# Altium project fNIRS_ECU.PrjPcb (part 2 of 3)

## Sheet MCU.SchDoc: fNIRS - MCU
size A3; CompanyName: UofT Capstone Team 2024991; Revision: 1; SheetNumber: 3; SheetTotal: 13
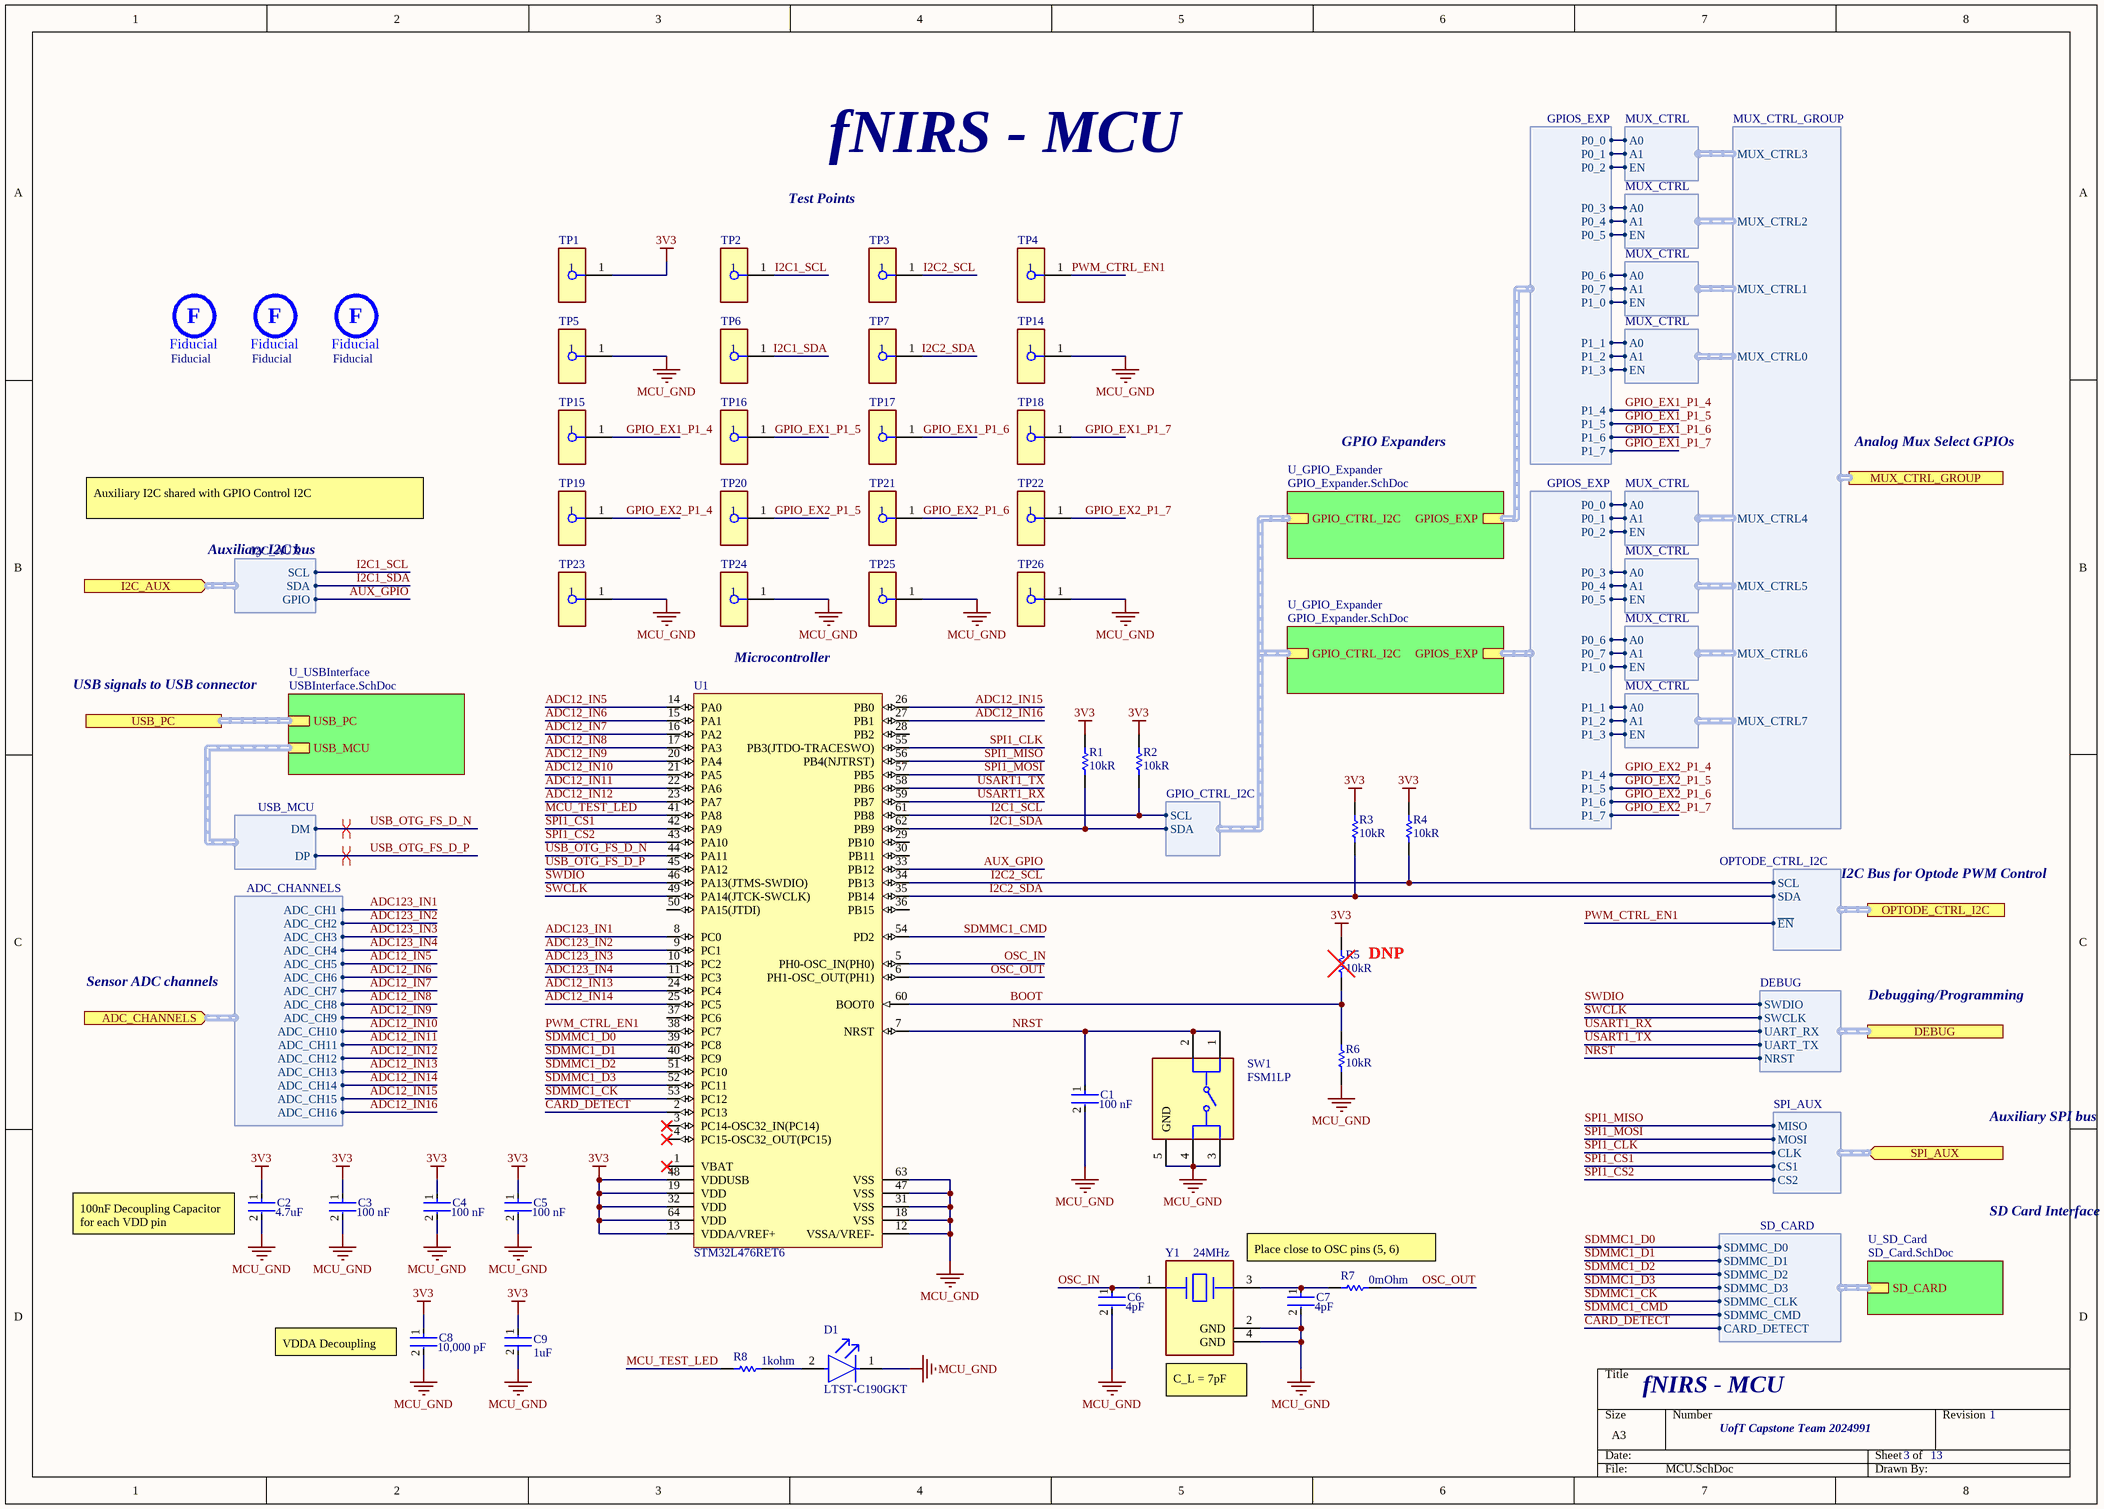
[diagram p7: MCU.SchDoc]

### Parts
C1  Capacitance: 100 nF  [FP-CC0603-DA-MFG]  (hidden comment: CC0603KRX7R7BB104)
C2  Capacitance: 4.7uF  [FP-C0603-CG-MFG]  (hidden comment: C0603C475K9PACTU)
C3  Capacitance: 100 nF  [FP-CC0603-DA-MFG]  (hidden comment: CC0603KRX7R7BB104)
C4  Capacitance: 100 nF  [FP-CC0603-DA-MFG]  (hidden comment: CC0603KRX7R7BB104)
C5  Capacitance: 100 nF  [FP-CC0603-DA-MFG]  (hidden comment: CC0603KRX7R7BB104)
C6  Capacitance: 4pF  [FP-CL10-IPC_A]  (hidden comment: CL10C040CB8NNNC)
C7  Capacitance: 4pF  [FP-CL10-IPC_A]  (hidden comment: CL10C040CB8NNNC)
C8  Capacitance: 10,000 pF  [FP-C0603C-CF-MFG]  (hidden comment: C0603C103K2RACTU)
C9  Capacitance: 1uF  [FP-C1608-080-0_1-IPC_B]  (hidden comment: C1608X5R1H105K080AB)
D1  LTST-C190GKT  [FP-LTST-C190GKT-MFG]
Fi1  Fiducial  [Fiducial-Footprint-1]
Fi2  Fiducial  [Fiducial-Footprint-1]
Fi3  Fiducial  [Fiducial-Footprint-1]
R1  Resistance: 10kR  [RESC1609X50X30NL8T20]  (hidden comment: CRCW060310K0FKEA)
R2  Resistance: 10kR  [RESC1609X50X30NL8T20]  (hidden comment: CRCW060310K0FKEA)
R3  Resistance: 10kR  [RESC1609X50X30NL8T20]  (hidden comment: CRCW060310K0FKEA)
R4  Resistance: 10kR  [RESC1609X50X30NL8T20]  (hidden comment: CRCW060310K0FKEA)
R5  Resistance: 10kR  [RESC1609X50X30NL8T20]  (hidden comment: CRCW060310K0FKEA)  (no BOM)
R6  Resistance: 10kR  [RESC1609X50X30NL8T20]  (hidden comment: CRCW060310K0FKEA)
R7  Resistance: 0mOhm  [RESC1608X55X25ML10T15]  (hidden comment: RC0603JR-070RL)
R8  Resistance: 1kohm  [RESC1608X55X25ML10T15]  (hidden comment: RC0603JR-071KL)
SW1  FSM1LP  [FP-FSM1LP-MFG]
TP1  S2761-46R  [FP-S2761-46R-MFG]  (value not drawn)
TP2  S2761-46R  [FP-S2761-46R-MFG]  (value not drawn)
TP3  S2761-46R  [FP-S2761-46R-MFG]  (value not drawn)
TP4  S2761-46R  [FP-S2761-46R-MFG]  (value not drawn)
TP5  S2761-46R  [FP-S2761-46R-MFG]  (value not drawn)
TP6  S2761-46R  [FP-S2761-46R-MFG]  (value not drawn)
TP7  S2761-46R  [FP-S2761-46R-MFG]  (value not drawn)
TP14  S2761-46R  [FP-S2761-46R-MFG]  (value not drawn)
TP15  S2761-46R  [FP-S2761-46R-MFG]  (value not drawn)
TP16  S2761-46R  [FP-S2761-46R-MFG]  (value not drawn)
TP17  S2761-46R  [FP-S2761-46R-MFG]  (value not drawn)
TP18  S2761-46R  [FP-S2761-46R-MFG]  (value not drawn)
TP19  S2761-46R  [FP-S2761-46R-MFG]  (value not drawn)
TP20  S2761-46R  [FP-S2761-46R-MFG]  (value not drawn)
TP21  S2761-46R  [FP-S2761-46R-MFG]  (value not drawn)
TP22  S2761-46R  [FP-S2761-46R-MFG]  (value not drawn)
TP23  S2761-46R  [FP-S2761-46R-MFG]  (value not drawn)
TP24  S2761-46R  [FP-S2761-46R-MFG]  (value not drawn)
TP25  S2761-46R  [FP-S2761-46R-MFG]  (value not drawn)
TP26  S2761-46R  [FP-S2761-46R-MFG]  (value not drawn)
U1  STM32L476RET6  [STM-LQFP64_L]
Y1  Frequency: 24MHz  [FP-ABM11W-MFG]  (hidden comment: ABM11W-24.0000MHZ-7-B1U-T3)

### Sub-sheets
U_GPIO_Expander = GPIO_Expander.SchDoc: GPIO_CTRL_I2C (harness GPIO_CTRL_I2C), GPIOS_EXP (harness GPIOS_EXP)
U_GPIO_Expander = GPIO_Expander.SchDoc: GPIO_CTRL_I2C (harness GPIO_CTRL_I2C), GPIOS_EXP (harness GPIOS_EXP)
U_SD_Card = SD_Card.SchDoc: SD_CARD (harness SD_CARD)
U_USBInterface = USBInterface.SchDoc: USB_MCU (harness USB_MCU), USB_PC (harness USB_PC)

### Ports
ADC_CHANNELS (in, harness ADC_CHANNELS, see Top[2C], Sensing[8C]), DEBUG (harness DEBUG, see Top[3C], Connectors[5C]), I2C_AUX (in, harness I2C_AUX, see Top[3C], Connectors[7B], OptodeConnectors[2B]), MUX_CTRL_GROUP (harness MUX_CTRL_GROUP, see Top[2C], Sensing[1A]), OPTODE_CTRL_I2C (harness OPTODE_CTRL_I2C, see Top[2C], OptodeControl[2B]), SPI_AUX (in, harness SPI_AUX, see Top[3C], Connectors[7B], OptodeConnectors[2A]), USB_PC (harness USB_PC, see Top[3C], Connectors[2C], USBInterface[1C])

### Harnesses
ADC_CHANNELS: ADC_CH1, ADC_CH2, ADC_CH3, ADC_CH4, ADC_CH5, ADC_CH6, ADC_CH7, ADC_CH8, ADC_CH9, ADC_CH10, ADC_CH11, ADC_CH12, ADC_CH13, ADC_CH14, ADC_CH15, ADC_CH16
GPIO_CTRL_I2C: SCL, SDA
USB_MCU: DM, DP
DEBUG: SWDIO, SWCLK, UART_RX, UART_TX, NRST
OPTODE_CTRL_I2C: SCL, SDA, ~{EN}
GPIOS_EXP: P0_0, P0_1, P0_2, P0_3, P0_4, P0_5, P0_6, P0_7, P1_0, P1_1, P1_2, P1_3, P1_4, P1_5, P1_6, P1_7
SPI_AUX: MISO, MOSI, CLK, CS1, CS2
SD_CARD: SDMMC_D0, SDMMC_D1, SDMMC_D2, SDMMC_D3, SDMMC_CLK, SDMMC_CMD, CARD_DETECT
MUX_CTRL: A0, A1, EN
MUX_CTRL_GROUP: MUX_CTRL0, MUX_CTRL1, MUX_CTRL3, MUX_CTRL2, MUX_CTRL4, MUX_CTRL5, MUX_CTRL6, MUX_CTRL7
I2C_AUX: SCL, SDA, GPIO

### Nets
3V3: C2.1 C3.1 C4.1 C5.1 C8.1 C9.1 R1.2 R2.2 R3.2 R4.2 R5.2 TP1.1 U1.13(VDDA/VREF+) U1.19(VDD) U1.32(VDD) U1.48(VDDUSB) U1.64(VDD)
MCU_GND: C1.2 C2.2 C3.2 C4.2 C5.2 C6.2 C7.2 C8.2 C9.2 D1.1(C) R6.1 SW1.3 SW1.4 SW1.5(GND) TP5.1 TP14.1 TP23.1 TP24.1 TP25.1 TP26.1 U1.12(VSSA/VREF-) U1.18(VSS) U1.31(VSS) U1.47(VSS) U1.63(VSS) Y1.2(GND) Y1.4(GND)
ADC12_IN5: U1.14(PA0) ; port ADC_CHANNELS.ADC_CH5
ADC12_IN6: U1.15(PA1) ; port ADC_CHANNELS.ADC_CH6
ADC12_IN7: U1.16(PA2) ; port ADC_CHANNELS.ADC_CH7
ADC12_IN8: U1.17(PA3) ; port ADC_CHANNELS.ADC_CH8
ADC12_IN9: U1.20(PA4) ; port ADC_CHANNELS.ADC_CH9
ADC12_IN10: U1.21(PA5) ; port ADC_CHANNELS.ADC_CH10
ADC12_IN11: U1.22(PA6) ; port ADC_CHANNELS.ADC_CH11
ADC12_IN12: U1.23(PA7) ; port ADC_CHANNELS.ADC_CH12
ADC12_IN13: U1.24(PC4) ; port ADC_CHANNELS.ADC_CH13
ADC12_IN14: U1.25(PC5) ; port ADC_CHANNELS.ADC_CH14
ADC12_IN15: U1.26(PB0) ; port ADC_CHANNELS.ADC_CH15
ADC12_IN16: U1.27(PB1) ; port ADC_CHANNELS.ADC_CH16
ADC123_IN1: U1.8(PC0) ; port ADC_CHANNELS.ADC_CH1
ADC123_IN2: U1.9(PC1) ; port ADC_CHANNELS.ADC_CH2
ADC123_IN3: U1.10(PC2) ; port ADC_CHANNELS.ADC_CH3
ADC123_IN4: U1.11(PC3) ; port ADC_CHANNELS.ADC_CH4
AUX_GPIO: U1.33(PB12) ; port I2C_AUX.GPIO
BOOT: R5.1 R6.2 U1.60(BOOT0)
CARD_DETECT: U1.2(PC13) ; sheet U_SD_Card/SD_CARD.CARD_DETECT
GPIO_EX1_P1_4: TP15.1 ; sheet U_GPIO_Expander/GPIOS_EXP.P1_4
GPIO_EX1_P1_5: TP16.1 ; sheet U_GPIO_Expander/GPIOS_EXP.P1_5
GPIO_EX1_P1_6: TP17.1 ; sheet U_GPIO_Expander/GPIOS_EXP.P1_6
GPIO_EX1_P1_7: TP18.1 ; sheet U_GPIO_Expander/GPIOS_EXP.P1_7
GPIO_EX2_P1_4: TP19.1 ; sheet U_GPIO_Expander/GPIOS_EXP.P1_4
GPIO_EX2_P1_5: TP20.1 ; sheet U_GPIO_Expander/GPIOS_EXP.P1_5
GPIO_EX2_P1_6: TP21.1 ; sheet U_GPIO_Expander/GPIOS_EXP.P1_6
GPIO_EX2_P1_7: TP22.1 ; sheet U_GPIO_Expander/GPIOS_EXP.P1_7
GPIO_P0_0: sheet U_GPIO_Expander/GPIOS_EXP.P0_0, harness MUX_CTRL.A0
GPIO_P0_0: sheet U_GPIO_Expander/GPIOS_EXP.P0_0, harness MUX_CTRL.A0  [a separate net that carries the same name]
GPIO_P0_1: sheet U_GPIO_Expander/GPIOS_EXP.P0_1, harness MUX_CTRL.A1
GPIO_P0_1: sheet U_GPIO_Expander/GPIOS_EXP.P0_1, harness MUX_CTRL.A1  [a separate net that carries the same name]
GPIO_P0_2: sheet U_GPIO_Expander/GPIOS_EXP.P0_2, harness MUX_CTRL.EN
GPIO_P0_2: sheet U_GPIO_Expander/GPIOS_EXP.P0_2, harness MUX_CTRL.EN  [a separate net that carries the same name]
GPIO_P0_3: sheet U_GPIO_Expander/GPIOS_EXP.P0_3, harness MUX_CTRL.A0
GPIO_P0_3: sheet U_GPIO_Expander/GPIOS_EXP.P0_3, harness MUX_CTRL.A0  [a separate net that carries the same name]
GPIO_P0_4: sheet U_GPIO_Expander/GPIOS_EXP.P0_4, harness MUX_CTRL.A1
GPIO_P0_4: sheet U_GPIO_Expander/GPIOS_EXP.P0_4, harness MUX_CTRL.A1  [a separate net that carries the same name]
GPIO_P0_5: sheet U_GPIO_Expander/GPIOS_EXP.P0_5, harness MUX_CTRL.EN
GPIO_P0_5: sheet U_GPIO_Expander/GPIOS_EXP.P0_5, harness MUX_CTRL.EN  [a separate net that carries the same name]
GPIO_P0_6: sheet U_GPIO_Expander/GPIOS_EXP.P0_6, harness MUX_CTRL.A0
GPIO_P0_6: sheet U_GPIO_Expander/GPIOS_EXP.P0_6, harness MUX_CTRL.A0  [a separate net that carries the same name]
GPIO_P0_7: sheet U_GPIO_Expander/GPIOS_EXP.P0_7, harness MUX_CTRL.A1
GPIO_P0_7: sheet U_GPIO_Expander/GPIOS_EXP.P0_7, harness MUX_CTRL.A1  [a separate net that carries the same name]
GPIO_P1_0: sheet U_GPIO_Expander/GPIOS_EXP.P1_0, harness MUX_CTRL.EN
GPIO_P1_0: sheet U_GPIO_Expander/GPIOS_EXP.P1_0, harness MUX_CTRL.EN  [a separate net that carries the same name]
GPIO_P1_1: sheet U_GPIO_Expander/GPIOS_EXP.P1_1, harness MUX_CTRL.A0
GPIO_P1_1: sheet U_GPIO_Expander/GPIOS_EXP.P1_1, harness MUX_CTRL.A0  [a separate net that carries the same name]
GPIO_P1_2: sheet U_GPIO_Expander/GPIOS_EXP.P1_2, harness MUX_CTRL.A1
GPIO_P1_2: sheet U_GPIO_Expander/GPIOS_EXP.P1_2, harness MUX_CTRL.A1  [a separate net that carries the same name]
GPIO_P1_3: sheet U_GPIO_Expander/GPIOS_EXP.P1_3, harness MUX_CTRL.EN
GPIO_P1_3: sheet U_GPIO_Expander/GPIOS_EXP.P1_3, harness MUX_CTRL.EN  [a separate net that carries the same name]
I2C1_SCL: R2.1 TP2.1 U1.61(PB8) ; sheet U_GPIO_Expander/GPIO_CTRL_I2C.SCL, port I2C_AUX.SCL
I2C1_SDA: R1.1 TP6.1 U1.62(PB9) ; sheet U_GPIO_Expander/GPIO_CTRL_I2C.SDA, port I2C_AUX.SDA
I2C2_SCL: R4.1 TP3.1 U1.34(PB13) ; port OPTODE_CTRL_I2C.SCL
I2C2_SDA: R3.1 TP7.1 U1.35(PB14) ; port OPTODE_CTRL_I2C.SDA
MCU_TEST_LED: R8.1 U1.41(PA8)
NRST: C1.1 SW1.1 SW1.2 U1.7(NRST) ; port DEBUG.NRST
OSC_IN: C6.1 U1.5(PH0-OSC_IN(PH0)) Y1.1
OSC_OUT: R7.2 U1.6(PH1-OSC_OUT(PH1))
PWM_CTRL_EN1: TP4.1 U1.38(PC7) ; port OPTODE_CTRL_I2C.~{EN}
SDMMC1_CK: U1.53(PC12) ; sheet U_SD_Card/SD_CARD.SDMMC_CLK
SDMMC1_CMD: U1.54(PD2) ; sheet U_SD_Card/SD_CARD.SDMMC_CMD
SDMMC1_D0: U1.39(PC8) ; sheet U_SD_Card/SD_CARD.SDMMC_D0
SDMMC1_D1: U1.40(PC9) ; sheet U_SD_Card/SD_CARD.SDMMC_D1
SDMMC1_D2: U1.51(PC10) ; sheet U_SD_Card/SD_CARD.SDMMC_D2
SDMMC1_D3: U1.52(PC11) ; sheet U_SD_Card/SD_CARD.SDMMC_D3
SPI1_CLK: U1.55(PB3(JTDO-TRACESWO)) ; port SPI_AUX.CLK
SPI1_CS1: U1.42(PA9) ; port SPI_AUX.CS1
SPI1_CS2: U1.43(PA10) ; port SPI_AUX.CS2
SPI1_MISO: U1.56(PB4(NJTRST)) ; port SPI_AUX.MISO
SPI1_MOSI: U1.57(PB5) ; port SPI_AUX.MOSI
SWCLK: U1.49(PA14(JTCK-SWCLK)) ; port DEBUG.SWCLK
SWDIO: U1.46(PA13(JTMS-SWDIO)) ; port DEBUG.SWDIO
USART1_RX: U1.59(PB7) ; port DEBUG.UART_RX
USART1_TX: U1.58(PB6) ; port DEBUG.UART_TX
USB_OTG_FS_D_N: U1.44(PA11) ; sheet U_USBInterface/USB_MCU.DM
USB_OTG_FS_D_P: U1.45(PA12) ; sheet U_USBInterface/USB_MCU.DP
NetC7_1: C7.1 R7.1 Y1.3
NetD1_2: D1.2(A) R8.2

Not connected (* = marked no-connect by the designer): U1 1(VBAT)* 3(PC14-OSC32_IN(PC14))* 4(PC15-OSC32_OUT(PC15))* 28(PB2) 29(PB10) 30(PB11) 36(PB15) 37(PC6) 50(PA15(JTDI))

### Buses and harness runs
harness port USB_PC = sheet U_USBInterface/USB_PC

### Layout directives
differential pair: USB_OTG_FS_D_N, USB_OTG_FS_D_P

### Notes on the sheet
- fNIRS - MCU
- Test Points
- GPIO Expanders
- Analog Mux Select GPIOs
- Auxiliary I2C shared with GPIO Control I2C
- Auxiliary I2C bus
- USB signals to USB connector
- Microcontroller
- I2C Bus for Optode PWM Control
- Sensor ADC channels
- (near R5) DNP
- Debugging/Programming
- Auxiliary SPI bus
- (near C2) 100nF Decoupling Capacitor for each VDD pin
- Place close to OSC pins (5, 6)
- SD Card Interface
- (near C8) VDDA Decoupling
- (near Y1) C_L = 7pF
- (in symbol CMP-ROOT-0065-2) F

### Library data of the parts
C1 C3-C5 = CMP-2000-05002-2: CAP CER 0.1UF 16V X7R 0603; Manufacturer: YAGEO; Tolerance: 0.1; Value: 100 nF; Temperature Coefficient: 15%; Material: Ceramic; Voltage Rating: 16 V; Package: CC0603-DA; ComponentLink2Description: Datasheet; Octopart: https://octopart.com/cc0603krx7r7bb104-yageo-192941; Temperature Range High: +125°C; Digikey Description: CAP CER 0.1UF 16V X7R 0603; Voltage: 16 V; Device Class L2: Capacitors; Height: 0.9mm; Temperature: -55°C to +125°C; Manufacturer Part Number: CC0603KRX7R7BB104; Device Class L1: Passive Components; Device Class L3: Ceramic Capacitors; ComponentLink2URL: http://www.yageo.com/documents/recent/UPY-GPHC_X7R_6.3V-to-50V_18.pdf; Footprint Url: http://www.yageo.com/exep/pages/download/literatures/UPY-C_GEN_24.pdf; RoHS: TRUE; Temperature Range Low: -55°C; Temperature Characteristic: X7R; Lead Free: Yes; Category: Cap; Mouser Description: Multilayer Ceramic Capacitor, CC Series, 0.1 - F, - 10%, X7R, 16 V, 0603 [1608 Metric]; Automotive: No
C2 = CMP-2006-02256-2: CAP CER 4.7UF 6.3V X5R 0603; Manufacturer: Kemet; Temperature Coefficient: 15%; Tolerance: 10%; Material: Ceramic; Device Class L3: Ceramic Capacitors; RoHS: TRUE; Value: 4.7uF; Lead Free: Yes; ComponentLink2Description: Datasheet; Mouser Description: Multilayer Ceramic Capacitors MLCC - SMD/SMT 6.3volts 4.7uF X5R 10%; Package: C0603-CG; Digikey Description: CAP CER 4.7UF 6.3V X5R 0603; ComponentLink2URL: https://content.kemet.com/datasheets/KEM_C1006_X5R_SMD.pdf; Category: Cap; Temperature Range Low: -55°C; Temperature: -55°C to +85°C; Octopart: https://octopart.com/c0603c475k9pactu-kemet-104242; Ipc Land Pattern Name: CAPC16080X80; Voltage Rating: 6.3V; Temperature Range High: +85°C; Height: 0.9mm; Temperature Characteristic: X5R; Device Class L1: Passive Components; Manufacturer Part Number: C0603C475K9PACTU; Automotive: No; Device Class L2: Capacitors
C6 C7 = CMP-13271-003969-1: Cap Ceramic 4pF 50V C0G ±0.25pF Pad SMD 0603 +125°C T/R; Tolerance: -0.25%; Case Code (Imperial): 0603; Packaging: Tape and Reel; Contact Plating: Tin; Thickness: 0.035inch; Dielectric: C0G; Max Operating Temperature: 125°C; Voltage Rating: 50V; Radiation Hardening: No; Case Code (Metric): 1608; Depth: 0.8mm; Mount: Surface Mount; Lead Free: Lead Free; Height: 0.8mm; Package Quantity: 1; Case/Package: 0603; Min Operating Temperature: -55°C; Voltage Rating (DC): 50V; Length: 1.6mm; Width: 0.031inch
C8 = CMP-2006-03038-2: CAP CER 10000PF 200V X7R 0603; Manufacturer: KEMET; Material: Ceramic; Value: 10,000 pF; Temperature Coefficient: 30ppm/°C; Tolerance: 0.1; Automotive Grade: Grade 1; Voltage Rating: 200 V; Manufacturer Part Number: C0603C103K2RACTU; ComponentLink2Description: Datasheet; Package: C0603C-CF; Device Class L2: Capacitors; Mouser Description: Multilayer Ceramic Capacitors MLCC - SMD/SMT 200volts 10000pF X7R 10%; Device Class L3: Ceramic Capacitors; Temperature Range Low: -55°C; Category: Cap; Device Class L1: Passive Components; Lead Free: Yes; Octopart: https://octopart.com/c0603c103k2ractu-kemet-1061947; ComponentLink2URL: https://api.kemet.com/component-edge/download/datasheet/C0603C100J5GACAUTO.pdf; Temperature Characteristic: X7R; Temperature: -55°C to +125°C; Automotive: Yes; Temperature Range High: +125°C; Digikey Description: CAP CER 10000PF 200V X7R 0603; Height: 0.87mm; RoHS: TRUE
C9 = CMP-2000-06025-2: Multilayer Ceramic Capacitors 1μF ±10% 50V X5R SMD 0603; Lead Free: Lead Free; Height: 0.8mm; Mount: Surface Mount; Radiation Hardening: No; Thickness: 0.035inch; Length: 1.6mm; Max Operating Temperature: 85°C; REACH SVHC: No SVHC; Min Operating Temperature: -55°C; Construction: Flat; RoHS Compliant: Yes; Voltage Rating: 50V; Dielectric: X5R; Packaging: Tape and Reel; Termination: SMD/SMT; Voltage Rating (DC): 50V; Case Code (Imperial): 0603; Voltage: 50V; Width: 0.031inch; Weight: 7.1E-05oz; Depth: 0.8mm; Case Code (Metric): 1608; Series: C; Case/Package: 0603; Tolerance: 10%; Resistor Type: Ceramic; Number of Pins: 2; Dielectric Material: Ceramic; Package Quantity: 1
D1 = CMP-22017-000005-2: LED GREEN CLEAR CHIP SMD; Dominant Wavelength: 569nm; Reverse Voltage: 5V; Lens Color: Colorless; Viewing Angle: 130°; Voltage: 2V; Forward Current: 30mA; Power Dissipation: 100mW; Luminous Intensity: 6mcd; Number of LEDs: 1; Forward Voltage: 2.1V; Wavelength: 565nm; Test Current: 10mA; Min Operating Temperature: -55°C; Lens Style: Clear; Mount: Surface Mount; Width: 0.8mm; Packaging: Tape and Reel; Lens Transparency: Clear; Case Code (Metric): 1608; Depth: 0.8mm; Case Code (Imperial): 0603; Case/Package: 0603; Number of Pins: 2; Max Operating Temperature: 85°C; Lead Free: Lead Free; Number of Elements: 1; Length: 1.6mm; Height: 0.8mm; Package Quantity: 1; Power Rating: 100mW; Radiation Hardening: No; Illumination Color: Green; Color: Green
Fi1-Fi3 = CMP-ROOT-0065-2: Fiducial for pick-and-place; Mount: TH; RoHS: Yes
R1-R6 = CMP-1666-00005-4: Chip Resistor, 10 KOhm, +/- 1%, 100 mW, -55 to 155 degC, 0603 (1608 Metric), RoHS, Tape and Reel; Manufacturer: Vishay Semiconductor; Voltage Rating: 75 V; Max Operating Temperature: 155 degC; PackageDescription: 2-Pin Surface Mount Device, Body 1.575 x 0.85 mm; ComponentLink1Description: Manufacturer URL; RoHSCompliant: true; PackageReference: 0603; REACH SVHC: Unknown; Length: 1.55 mm; DatasheetVersion: 06/2012; Packaging: Tape and Reel; Min Operating Temperature: -55 degC; Mounting Technology: Surface Mount; ComponentLink2URL: https://datasheet.ciiva.com/11809/0900766b80d98afc-11809037.pdf; Height: 0.45 mm; ComponentLink2Description: Datasheet; Package Quantity: 5000; ComponentLink1URL: http://www.vishay.com/
R7 = CMP-2100-03667-1: Chip Resistor, 0 Ohm, +/- 5%, 0.1 W, -55 to 155 degC, 0603 (1608 Metric), RoHS, Tape and Reel; Manufacturer: Yageo; Temperature Coefficient: 200ppm/degreesC; Voltage Rating: 50V; Power Rating: 100mW; Width: 0.8mm; Max Operating Temperature: 155degC; Tolerance: 5%; Package Reference: 0603; Height: 0.45mm; Depth: 0.8mm; Package Description: 2-Pin Surface Mount Device, Body 1.6 x 0.8 mm; Termination: SMD/SMT; Package Quantity: 5000; Case/Package: 0603; Case Code (Imperial): 0603; Radiation Hardening: No; Number of Pins: 2; Length: 1.6mm; Lead Free: LeadFree; Voltage Rating (DC): 50V; Military Standard: Not; Datasheet URL: http://www.yageo.com/NewPortal/yageodocoutput?fileName=/pdf/R-Chip/PYu-RC_Group_51_RoHS_L_5.pdf; Manufacturer URL: http://www.yageo.com/; Packaging: TapeandReel; Case Code (Metric): 1608; Min Operating Temperature: -55degC; Composition: ThickFilm; RoHSCompliant: true; Contact Plating: Tin; Datasheet Version: Rev. 5, 10/2016; REACH SVHC: NoSVHC
R8 = CMP-2000-05023-1: Chip Resistor, 1 KOhm, +/- 5%, 0.063 W, -55 to 155 degC, 0603 (1608 Metric), RoHS, Tape and Reel; Manufacturer: Yageo; Resistor Case Style: 0603[1608Metric]; Resistor Element Type: ThickFilm; Product Range: RCSeries; SVHC: ToBeAdvised; Voltage Rating: 50V; Temperature Coefficient: ±100ppm/degC; Power Rating: 100mW; Packaging: CutTape; Manufacturer URL: http://www.yageo.com/; Resistance Tolerance: ±5%; Datasheet Version: Rev. 4, 04/2009; MSL: MSL1-Unlimited; Package Description: 2-Pin Surface Mount Device, Body 1.6 x 0.8 mm; Automotive Qualification Standard: -; Package Reference: 603; Datasheet URL: https://datasheet.ciiva.com/2452/pyu-rc0603-51-rohs-l-4-2452848.pdf
SW1 = CMP-03402-000015-1: SWITCH TACTILE SPST-NO 0.05A 24V; Electrical Life: 100000Cycles; Actuator Type: Standard; Contact Resistance: 100mR; Current Rating: 50mA; Operating Force: 1.57N; Actuator Material: Polyphthalamide; Illumination Type: Non-Illuminated; Actuator Length: 0.01inch; Voltage Rating (DC): 12V; Throw Configuration: SPST; Switch Travel: 0.25mm; Switch Function: Off-Mom; Actuator Color: Black; Length: 6.19mm; Min Operating Temperature: -35°C; Contact Material: Copper Alloy; Max Current Rating: 50mA; Max Operating Temperature: 85°C; Packaging: Loose Piece; Lead Free: Lead Free; Mount: Surface Mount; RoHS Compliant: Yes; Orientation: Straight; Package Quantity: 2000; Mechanical Life: 100000Cycles; Type: Switch; ELV: Compliant; Depth: 8mm; Contact Plating: Silver; Max Voltage Rating (DC): 12V; REACH SVHC: No SVHC; Series: FSM1LP; Contact Current Rating: 50mA; Termination: Gull Wing
TP1-TP7 TP14-TP26 = CMP-15817-000011-1: PC TEST POINT NATURAL; Body Material: Brass; Plating: Tin; Material: Copper Alloy; Mount: Surface Mount; Color: Natural; Packaging: Tape and Reel; RoHS Compliant: Yes
U1 = CMP-1655-00011-2: Ultra-Low-Power ARM Cortex-M4 32-bit MCU+FPU, 512 KB Flash, 128 KB Internal RAM, 51 I/Os, 64-Pin LQFP, -40 to 85 degC, Tray; Manufacturer: STMicroelectronics; Internal RAM Size (kB): 128; I/Os (High Current): 51; Operating Frequency(F) (Processor speed) (MHz): 80; FLASH Size (Prog) (kB): 512; D/A Converter: 2; Supply Voltage(Vcc) min (V): 1.71; Packing: Tray; DatasheetVersion: Rev. 4; PartNumber: STM32L476RET6; ComponentLink1URL: http://www.st.com/; Package Reference: LQFP64; Package Description: 64-Pin Low-profile Quad Flat Package, Body 10 x 10 mm, Pitch 0.5 mm; Mounting Technology: Surface Mount; ComponentLink1Description: Manufacturer URL; ComponentLink2Description: Datasheet; Core: ARM Cortex-M4; ComponentLink2URL: http://www.st.com/st-web-ui/static/active/en/resource/technical/document/datasheet/DM00108832.pdf
Y1 = CMP-27762-000556-1: Crystal 24MHz ±10ppm 7pF SMD-4 2mm x 1.6mm; RoHS Compliant: Yes

## Sheet GPIO_Expander.SchDoc: fNIRS - GPIO Expander
size A4; CompanyName: UofT Capstone Team 2024991; Revision: 1; SheetNumber: 4; SheetTotal: 13
Used 2 times, as channels U_MCU/U_GPIO_Expander, U_MCU/U_GPIO_Expander. Parts and nets are listed once, with the designators drawn on the sheet.
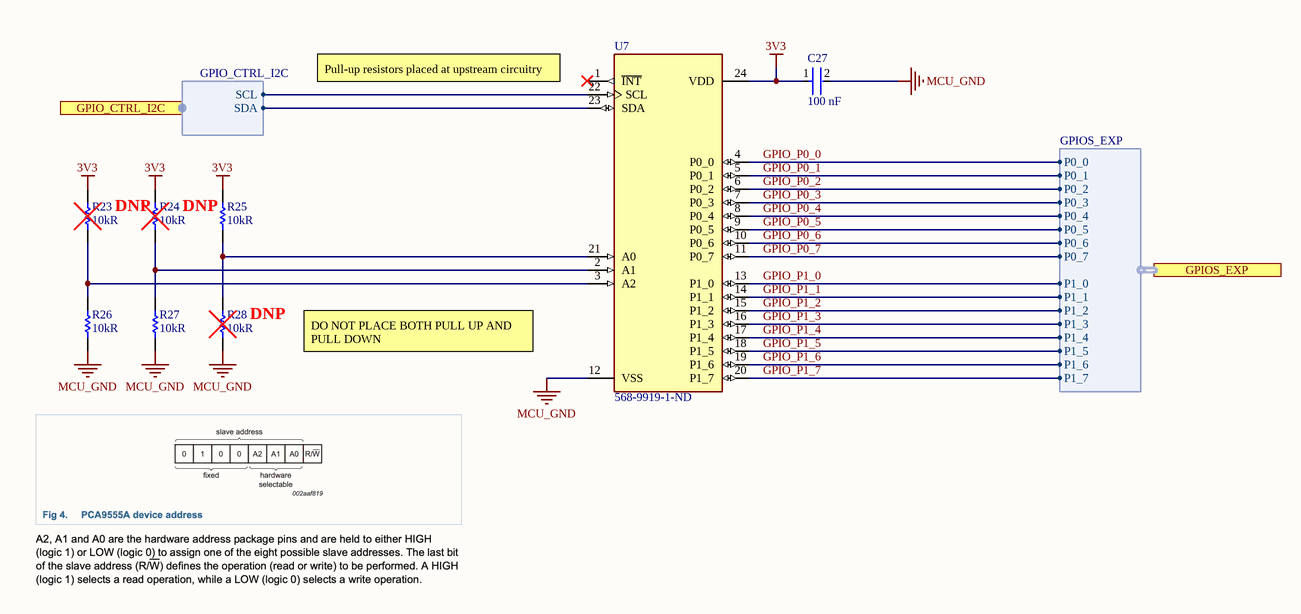
[diagram p8: GPIO_Expander.SchDoc]

### Parts
C27  Capacitance: 100 nF  [FP-CC0603-DA-MFG]  (hidden comment: CC0603KRX7R7BB104)
R23  Resistance: 10kR  [RESC1609X50X30NL8T20]  (hidden comment: CRCW060310K0FKEA)  (no BOM)
R24  Resistance: 10kR  [RESC1609X50X30NL8T20]  (hidden comment: CRCW060310K0FKEA)  (no BOM)
R25  Resistance: 10kR  [RESC1609X50X30NL8T20]  (hidden comment: CRCW060310K0FKEA)
R26  Resistance: 10kR  [RESC1609X50X30NL8T20]  (hidden comment: CRCW060310K0FKEA)
R27  Resistance: 10kR  [RESC1609X50X30NL8T20]  (hidden comment: CRCW060310K0FKEA)
R28  Resistance: 10kR  [RESC1609X50X30NL8T20]  (hidden comment: CRCW060310K0FKEA)  (no BOM)
U7  568-9919-1-ND  [SOP65P640X110-24N]

### Ports
GPIO_CTRL_I2C (harness GPIO_CTRL_I2C, see MCU[5B]), GPIOS_EXP (harness GPIOS_EXP, see MCU[6B])

### Harnesses
GPIO_CTRL_I2C: SCL, SDA
GPIOS_EXP: P0_0, P0_1, P0_2, P0_3, P0_4, P0_5, P0_6, P0_7, P1_0, P1_1, P1_2, P1_3, P1_4, P1_5, P1_6, P1_7

### Nets
3V3: C27.1 R23.2 R24.2 R25.2 U7.24(VDD)
MCU_GND: C27.2 R26.1 R27.1 R28.1 U7.12(VSS)
GPIO_P0_0: U7.4(P0_0) ; port GPIOS_EXP.P0_0
GPIO_P0_1: U7.5(P0_1) ; port GPIOS_EXP.P0_1
GPIO_P0_2: U7.6(P0_2) ; port GPIOS_EXP.P0_2
GPIO_P0_3: U7.7(P0_3) ; port GPIOS_EXP.P0_3
GPIO_P0_4: U7.8(P0_4) ; port GPIOS_EXP.P0_4
GPIO_P0_5: U7.9(P0_5) ; port GPIOS_EXP.P0_5
GPIO_P0_6: U7.10(P0_6) ; port GPIOS_EXP.P0_6
GPIO_P0_7: U7.11(P0_7) ; port GPIOS_EXP.P0_7
GPIO_P1_0: U7.13(P1_0) ; port GPIOS_EXP.P1_0
GPIO_P1_1: U7.14(P1_1) ; port GPIOS_EXP.P1_1
GPIO_P1_2: U7.15(P1_2) ; port GPIOS_EXP.P1_2
GPIO_P1_3: U7.16(P1_3) ; port GPIOS_EXP.P1_3
GPIO_P1_4: U7.17(P1_4) ; port GPIOS_EXP.P1_4
GPIO_P1_5: U7.18(P1_5) ; port GPIOS_EXP.P1_5
GPIO_P1_6: U7.19(P1_6) ; port GPIOS_EXP.P1_6
GPIO_P1_7: U7.20(P1_7) ; port GPIOS_EXP.P1_7
NetR23_1: R23.1 R26.2 U7.3(A2)
NetR24_1: R24.1 R27.2 U7.2(A1)
NetR25_1: R25.1 R28.2 U7.21(A0)
NetU7_22: U7.22(SCL) ; port GPIO_CTRL_I2C.SCL
NetU7_23: U7.23(SDA) ; port GPIO_CTRL_I2C.SDA

Not connected (* = marked no-connect by the designer): U7 1(~{INT})*

### Channels
U_MCU/U_GPIO_Expander: designators end in _U_MCU_U_GPIO_Expander#1
U_MCU/U_GPIO_Expander: designators end in _U_MCU_U_GPIO_Expander#2

### Notes on the sheet
- Pull-up resistors placed at upstream circuitry
- (near R24) DNP
- (near R25) DNP
- (near R28) DNP
- DO NOT PLACE BOTH PULL UP AND PULL DOWN

### Library data of the parts
C27 = CMP-2000-05002-2: as C1 on sheet MCU; Voltage Rating: 16 V; Package: CC0603-DA; ComponentLink2Description: Datasheet; Octopart: https://octopart.com/cc0603krx7r7bb104-yageo-192941; Temperature Range High: +125°C; Digikey Description: CAP CER 0.1UF 16V X7R 0603; Voltage: 16 V; Device Class L2: Capacitors; Height: 0.9mm; Temperature: -55°C to +125°C; Manufacturer Part Number: CC0603KRX7R7BB104; Device Class L1: Passive Components; Device Class L3: Ceramic Capacitors; ComponentLink2URL: http://www.yageo.com/documents/recent/UPY-GPHC_X7R_6.3V-to-50V_18.pdf; Footprint Url: http://www.yageo.com/exep/pages/download/literatures/UPY-C_GEN_24.pdf; RoHS: TRUE; Temperature Range Low: -55°C; Temperature Characteristic: X7R; Lead Free: Yes; Category: Cap; Mouser Description: Multilayer Ceramic Capacitor, CC Series, 0.1 - F, - 10%, X7R, 16 V, 0603 [1608 Metric]; Automotive: No
R23-R28 = CMP-1666-00005-4: as R1 on sheet MCU; Max Operating Temperature: 155 degC; PackageDescription: 2-Pin Surface Mount Device, Body 1.575 x 0.85 mm; ComponentLink1Description: Manufacturer URL; RoHSCompliant: true; PackageReference: 0603; REACH SVHC: Unknown; Length: 1.55 mm; DatasheetVersion: 06/2012; Packaging: Tape and Reel; Min Operating Temperature: -55 degC; Mounting Technology: Surface Mount; ComponentLink2URL: https://datasheet.ciiva.com/11809/0900766b80d98afc-11809037.pdf; Height: 0.45 mm; ComponentLink2Description: Datasheet; Package Quantity: 5000; ComponentLink1URL: http://www.vishay.com/
U7 = PCA9555APW,118: Parallel I/O Port, 16-Bit, 16 I/O, CMOS, PDSO24; Manufacturer: NXP Semiconductors; Package Body Material: Plastic; Number of Bits: 16; Number of Ports: 2; Package Equivalence Code: TSSOP24,.25; Power Supplies: 1.8/5V; Max Supply Voltage: 5.5V; Min Supply Voltage: 1.65V; Supply Voltage-Nom: 1.8V; Qualification Status: Not Qualified; Supplier 1: Digi-Key; Manufacturer Part Number: PCA9555APW,118; RoHS: Yes; Category: Interface ICs; Stock 1: 2619; Pricing 1: 1=2.30000, 10=2.06600, 25=1.94920, 100=1.66060, 250=1.55924, 500=1.36434, 1000=1.23255 (USD); Package Code: TSSOP; Number of Pins: 24; Package Shape: Rectangular; Min Operating Temperature: -40°C; Max Operating Temperature: 85°C; JESD-30 Code: R-PDSO-G24; Moisture Sensitivity Level: 1; Number of I/O Lines: 16; Package Style: SMALL OUTLINE, THIN PROFILE, SHRINK PITCHMeter; Surface Mount: Yes; Technology: CMOS; Terminal Form: Gull Wing; Terminal Position: DUAL; Length: 7.8mm; Width: 4.4mm; Height - Seated (Max): 1.1mm; Terminal Pitch: 0.65mm; Temperature Grade: INDUSTRIAL; REACH SVHC: Yes; RoHS Compliant: Yes; ComponentLink1URL: https://datasheet.ciiva.com:443/pdfs/VipMasterIC/IC/PHGL/PHGL-S-A0001284358/PHGL-S-A0001284358-1.pdf?src-supplier=IHS+Markit; ComponentLink1Description: https://datasheet.ciiva.com:443/pdfs/VipMasterIC/IC/PHGL/PHGL-S-A0001284358/PHGL-S-A0001284358-1.pdf?src-supplier=IHS+Markit; ComponentLink2URL: https://datasheet.ciiva.com/6633/pca9555a-6633195.pdf?src-supplier=Digi-Key; ComponentLink2Description: https://datasheet.ciiva.com/6633/pca9555a-6633195.pdf?src-supplier=Digi-Key; Supplier Part Number 1: 568-9919-1-ND

## Sheet SD_Card.SchDoc: fNIRS - SD Card
size A4; CompanyName: UofT Capstone Team 2024991; Revision: 1; SheetNumber: 5; SheetTotal: 13
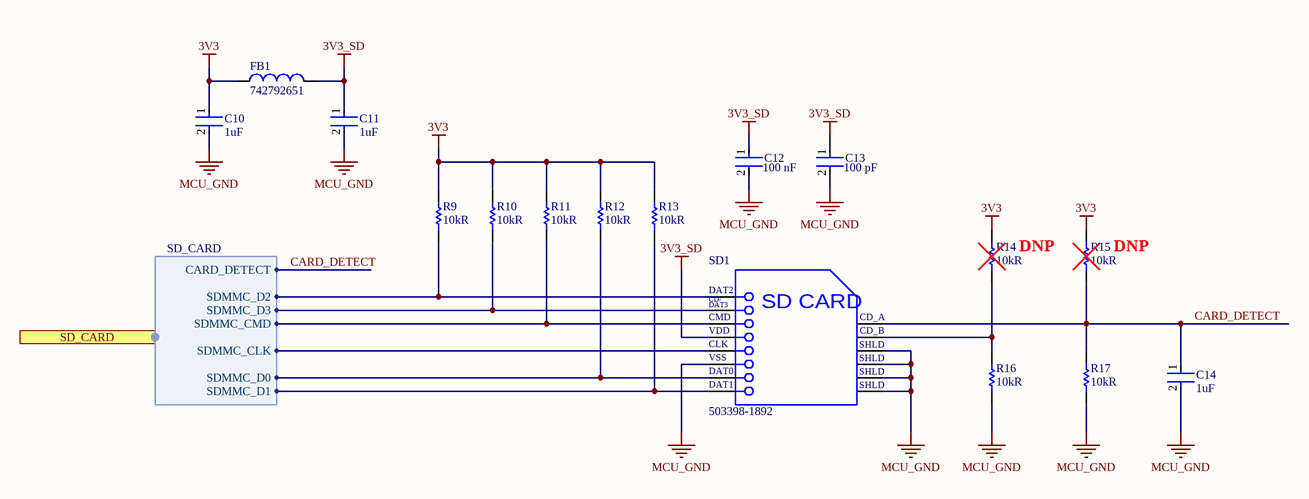
[diagram p9: SD_Card.SchDoc]

### Parts
C10  Capacitance: 1uF  [FP-C1608-080-0_1-IPC_B]  (hidden comment: C1608X5R1H105K080AB)
C11  Capacitance: 1uF  [FP-C1608-080-0_1-IPC_B]  (hidden comment: C1608X5R1H105K080AB)
C12  Capacitance: 100 nF  [FP-CC0603-DA-MFG]  (hidden comment: CC0603KRX7R7BB104)
C13  value 100 pF  [FP-C0603C-CF-MFG]  (hidden comment: C0603C101J5GACTU)
C14  Capacitance: 1uF  [FP-C1608-080-0_1-IPC_B]  (hidden comment: C1608X5R1H105K080AB)
FB1  742792651  [WE-CBF_0603_L1.6W0.8H0.8_HC]
R9  Resistance: 10kR  [RESC1609X50X30NL8T20]  (hidden comment: CRCW060310K0FKEA)
R10  Resistance: 10kR  [RESC1609X50X30NL8T20]  (hidden comment: CRCW060310K0FKEA)
R11  Resistance: 10kR  [RESC1609X50X30NL8T20]  (hidden comment: CRCW060310K0FKEA)
R12  Resistance: 10kR  [RESC1609X50X30NL8T20]  (hidden comment: CRCW060310K0FKEA)
R13  Resistance: 10kR  [RESC1609X50X30NL8T20]  (hidden comment: CRCW060310K0FKEA)
R14  Resistance: 10kR  [RESC1609X50X30NL8T20]  (hidden comment: CRCW060310K0FKEA)  (no BOM)
R15  Resistance: 10kR  [RESC1609X50X30NL8T20]  (hidden comment: CRCW060310K0FKEA)  (no BOM)
R16  Resistance: 10kR  [RESC1609X50X30NL8T20]  (hidden comment: CRCW060310K0FKEA)
R17  Resistance: 10kR  [RESC1609X50X30NL8T20]  (hidden comment: CRCW060310K0FKEA)
SD1  503398-1892  [MOLX-503398-1892_V]

### Ports
SD_CARD (harness SD_CARD, see MCU[8D])

### Harnesses
SD_CARD: SDMMC_D0, SDMMC_D1, SDMMC_D2, SDMMC_D3, SDMMC_CLK, SDMMC_CMD, CARD_DETECT

### Nets
3V3: C10.1 FB1.1 R9.2 R10.2 R11.2 R12.2 R13.2 R14.2 R15.2
3V3_SD: C11.1 C12.1 C13.1 FB1.2 SD1.4(VDD)
MCU_GND: C10.2 C11.2 C12.2 C13.2 C14.2 R16.1 R17.1 SD1.6(VSS) SD1.11(SHLD) SD1.12(SHLD) SD1.13(SHLD) SD1.14(SHLD)
CARD_DETECT: C14.1 R15.1 R17.2 SD1.9(CD_A) ; port SD_CARD.CARD_DETECT
SDMMC1_CK: SD1.5(CLK) ; port SD_CARD.SDMMC_CLK
SDMMC1_CMD: R11.1 SD1.3(CMD) ; port SD_CARD.SDMMC_CMD
SDMMC1_D0: R12.1 SD1.7(DAT0) ; port SD_CARD.SDMMC_D0
SDMMC1_D1: R13.1 SD1.8(DAT1) ; port SD_CARD.SDMMC_D1
SDMMC1_D2: R9.1 SD1.1(DAT2) ; port SD_CARD.SDMMC_D2
SDMMC1_D3: R10.1 SD1.2(CD/DAT3) ; port SD_CARD.SDMMC_D3
NetR14_1: R14.1 R16.2 SD1.10(CD_B)

### Notes on the sheet
- DNP
- (near R15) DNP
- (in symbol CMP-2000-05621-1) CD/; DAT3; SD CARD

### Library data of the parts
C10 C11 C14 = CMP-2000-06025-2: as C9 on sheet MCU; Lead Free: Lead Free; Height: 0.8mm; Mount: Surface Mount; Radiation Hardening: No; Thickness: 0.035inch; Length: 1.6mm; Max Operating Temperature: 85°C; REACH SVHC: No SVHC; Min Operating Temperature: -55°C; Construction: Flat; RoHS Compliant: Yes; Voltage Rating: 50V; Dielectric: X5R; Packaging: Tape and Reel; Termination: SMD/SMT; Voltage Rating (DC): 50V; Case Code (Imperial): 0603; Voltage: 50V; Width: 0.031inch; Weight: 7.1E-05oz; Depth: 0.8mm; Case Code (Metric): 1608; Series: C; Case/Package: 0603; Tolerance: 10%; Resistor Type: Ceramic; Number of Pins: 2; Dielectric Material: Ceramic; Package Quantity: 1
C12 = CMP-2000-05002-2: as C1 on sheet MCU; Voltage Rating: 16 V; Package: CC0603-DA; ComponentLink2Description: Datasheet; Octopart: https://octopart.com/cc0603krx7r7bb104-yageo-192941; Temperature Range High: +125°C; Digikey Description: CAP CER 0.1UF 16V X7R 0603; Voltage: 16 V; Device Class L2: Capacitors; Height: 0.9mm; Temperature: -55°C to +125°C; Manufacturer Part Number: CC0603KRX7R7BB104; Device Class L1: Passive Components; Device Class L3: Ceramic Capacitors; ComponentLink2URL: http://www.yageo.com/documents/recent/UPY-GPHC_X7R_6.3V-to-50V_18.pdf; Footprint Url: http://www.yageo.com/exep/pages/download/literatures/UPY-C_GEN_24.pdf; RoHS: TRUE; Temperature Range Low: -55°C; Temperature Characteristic: X7R; Lead Free: Yes; Category: Cap; Mouser Description: Multilayer Ceramic Capacitor, CC Series, 0.1 - F, - 10%, X7R, 16 V, 0603 [1608 Metric]; Automotive: No
C13 = CMP-2006-03408-2: CAP CER 100PF 50V C0G/NP0 0603; Manufacturer: KEMET; Material: Ceramic; Tolerance: 0.05; Automotive Grade: Grade 1; Temperature Coefficient: 30ppm/°C; Temperature Characteristic: C0G; RoHS: TRUE; Temperature Range Low: -55°C; Automotive: Yes; Digikey Description: CAP CER 100PF 50V C0G/NP0 0603; Voltage Rating: 50 V; Lead Free: Yes; Category: Cap; Manufacturer Part Number: C0603C101J5GACTU; Device Class L3: Ceramic Capacitors; Mouser Description: Multilayer Ceramic Capacitor, C Series, 100 Pf, - 5%, C0g / Np0, 50 V, 0603 [1608 Metric] Rohs Compliant: Yes; Device Class L1: Passive Components; Temperature: -55°C to +125°C; ComponentLink2URL: https://api.kemet.com/component-edge/download/datasheet/C0603C100J5GACAUTO.pdf; Temperature Range High: +125°C; ComponentLink2Description: Datasheet; Octopart: https://octopart.com/c0603c101j5gactu-kemet-100052; Device Class L2: Capacitors; Height: 0.87mm; Capacitance: 100 pF; Package: C0603C-CF
FB1 = CMP-0220-00181-3: NexarPartId: 7864500; RMS Current (Irms): 1A; Number of Lines: 1; Test Frequency: 100MHz; Impedance: 600Ω; Inductance: 360mH; Resistance: 200mΩ; Tolerance: 25%; Case Code (Imperial): 0603; Lead Free: Lead Free; Current Rating: 1A; Height: 800µm; Min Operating Temperature: -55°C; Core Material: Ferrite; REACH SVHC: Unknown; Case/Package: 0603; Weight: 3.997283mg; Mount: Surface Mount; Termination: SMD/SMT; Case Code (Metric): 1608; DC Resistance (DCR): 200mΩ; Series Resistance: 200mΩ; Max Operating Temperature: 125°C; Width: 800µm; Length: 1.6mm; Max DC Current: 1A; RoHS: Compliant; Material: Ferrite; Max Current Rating: 1A; Depth: 800µm; Packaging: Cut Tape (CT)
R9-R17 = CMP-1666-00005-4: as R1 on sheet MCU; Max Operating Temperature: 155 degC; PackageDescription: 2-Pin Surface Mount Device, Body 1.575 x 0.85 mm; ComponentLink1Description: Manufacturer URL; RoHSCompliant: true; PackageReference: 0603; REACH SVHC: Unknown; Length: 1.55 mm; DatasheetVersion: 06/2012; Packaging: Tape and Reel; Min Operating Temperature: -55 degC; Mounting Technology: Surface Mount; ComponentLink2URL: https://datasheet.ciiva.com/11809/0900766b80d98afc-11809037.pdf; Height: 0.45 mm; ComponentLink2Description: Datasheet; Package Quantity: 5000; ComponentLink1URL: http://www.vishay.com/
SD1 = CMP-2000-05621-1: Micro SD Connector, Pitch 1.1 mm, 8 Position, Height 1.4 mm, -25 to 85 degC, RoHS, Tape and Reel; Manufacturer: Molex; Voltage Rating: 10VAC/DC; Current Rating: 500mA; Manufacturer URL: http://www.molex.com/; Package Reference: 503398-1892; Packaging: Reel; RoHS: Details; Brand: Molex; Datasheet URL: http://www.molex.com/pdm_docs/sd/5033981892_sd.pdf; Mounting Technology: SurfaceMount; Factory Pack Quantity: 2400; Datasheet Version: Rev. E, 04/2006; Series: 503398; Product Category: MemoryCardConnectors; Package Description: Micro SD Connector, Pitch 1.1 mm, 8 Position, Height 1.4 mm

## Sheet USBInterface.SchDoc: fNIRS - USB Interface
size A4; CompanyName: UofT Capstone Team 2024991; Revision: 1; SheetNumber: 6; SheetTotal: 13
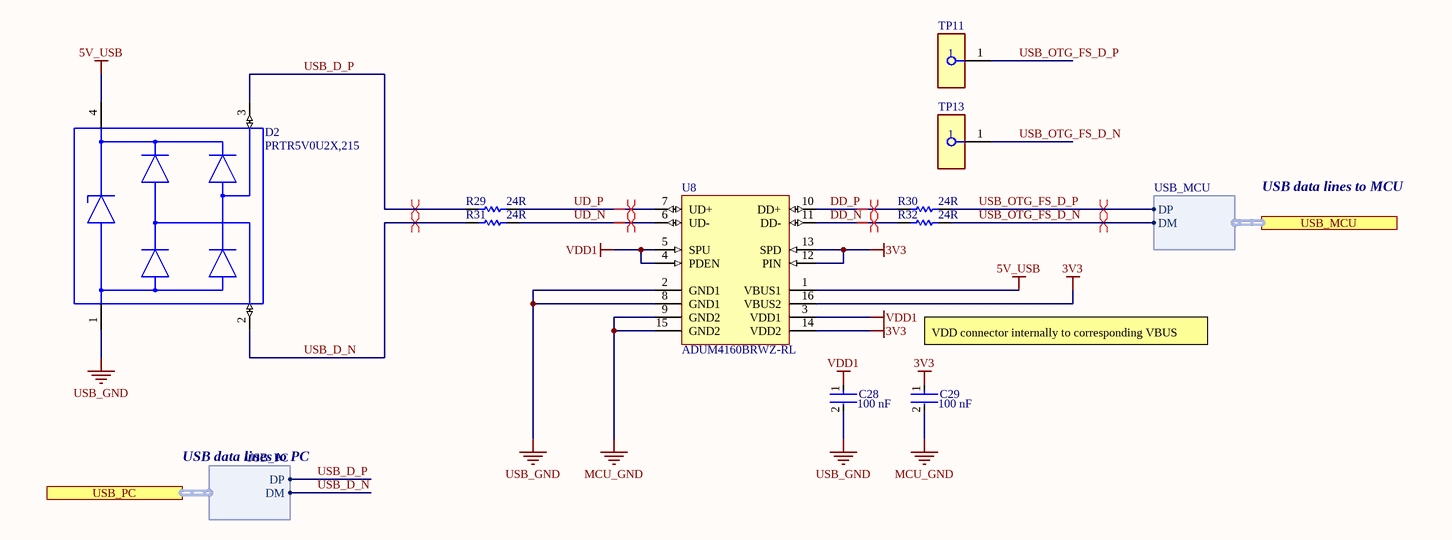
[diagram p10: USBInterface.SchDoc]

### Parts
C28  Capacitance: 100 nF  [FP-CC0603-DA-MFG]  (hidden comment: CC0603KRX7R7BB104)
C29  Capacitance: 100 nF  [FP-CC0603-DA-MFG]  (hidden comment: CC0603KRX7R7BB104)
D2  PRTR5V0U2X,215  [FP-SOT143B-MFG]
R29  Resistance: 24R  [RESC1608X55X30ML15T15]  (hidden comment: ERJ-3EKF24R0V)
R30  Resistance: 24R  [RESC1608X55X30ML15T15]  (hidden comment: ERJ-3EKF24R0V)
R31  Resistance: 24R  [RESC1608X55X30ML15T15]  (hidden comment: ERJ-3EKF24R0V)
R32  Resistance: 24R  [RESC1608X55X30ML15T15]  (hidden comment: ERJ-3EKF24R0V)
TP11  S2761-46R  [FP-S2761-46R-MFG]  (value not drawn)
TP13  S2761-46R  [FP-S2761-46R-MFG]  (value not drawn)
U8  ADUM4160BRWZ-RL  [RW-16_L]

### Ports
USB_MCU (harness USB_MCU, see MCU[2B]), USB_PC (harness USB_PC, see MCU[2B], Connectors[1C], MCU[1B])

### Harnesses
USB_MCU: DM, DP
USB_PC: DM, DP

### Nets
3V3: C29.1 U8.12(PIN) U8.13(SPD) U8.14(VDD2) U8.16(VBUS2)
5V_USB: D2.4(VCC) U8.1(VBUS1)
MCU_GND: C29.2 U8.9(GND2) U8.15(GND2)
USB_GND: C28.2 D2.1(GND) U8.2(GND1) U8.8(GND1)
VDD1: C28.1 U8.3(VDD1) U8.4(PDEN) U8.5(SPU)
DD_N: R32.1 U8.11(DD-)
DD_P: R30.1 U8.10(DD+)
UD_N: R31.2 U8.6(UD-)
UD_P: R29.2 U8.7(UD+)
USB_D_N: D2.2(I/O_1) R31.1 ; port USB_PC.DM
USB_D_P: D2.3(I/O_2) R29.1 ; port USB_PC.DP
USB_OTG_FS_D_N: R32.2 TP13.1 ; port USB_MCU.DM
USB_OTG_FS_D_P: R30.2 TP11.1 ; port USB_MCU.DP

### Layout directives
differential pair: DD_N, DD_P, UD_N, UD_P, USB_D_N, USB_D_P, USB_OTG_FS_D_N, USB_OTG_FS_D_P

### Notes on the sheet
- USB data lines to MCU
- (near C29) VDD connector internally to corresponding VBUS
- USB data lines to PC

### Library data of the parts
C28 C29 = CMP-2000-05002-2: as C1 on sheet MCU; Voltage Rating: 16 V; Package: CC0603-DA; ComponentLink2Description: Datasheet; Octopart: https://octopart.com/cc0603krx7r7bb104-yageo-192941; Temperature Range High: +125°C; Digikey Description: CAP CER 0.1UF 16V X7R 0603; Voltage: 16 V; Device Class L2: Capacitors; Height: 0.9mm; Temperature: -55°C to +125°C; Manufacturer Part Number: CC0603KRX7R7BB104; Device Class L1: Passive Components; Device Class L3: Ceramic Capacitors; ComponentLink2URL: http://www.yageo.com/documents/recent/UPY-GPHC_X7R_6.3V-to-50V_18.pdf; Footprint Url: http://www.yageo.com/exep/pages/download/literatures/UPY-C_GEN_24.pdf; RoHS: TRUE; Temperature Range Low: -55°C; Temperature Characteristic: X7R; Lead Free: Yes; Category: Cap; Mouser Description: Multilayer Ceramic Capacitor, CC Series, 0.1 - F, - 10%, X7R, 16 V, 0603 [1608 Metric]; Automotive: No
D2 = CMP-14436-000007-1: TVS DIODE 5.5V SOT143B
R29-R32 = CMP-1012-00325-2: Manufacturer: Panasonic; Part Number: ERJ-3EKF24R0V
TP11 TP13 = CMP-15817-000011-1: as TP1 on sheet MCU; Material: Copper Alloy; Mount: Surface Mount; Color: Natural; Packaging: Tape and Reel; RoHS Compliant: Yes
U8 = CMP-0534-00648-1: Full/Low Speed USB Digital Isolator, 2 Channels, 5 kV rms, 3.1 to 5.5 V, -40 to 105 degC, 16-Pin SOIC (RW-16), RoHS, Reel; Manufacturer: Analog Devices; Number of Channels: 2; IDD@12 Mbps: 8 mA Max.; Data Rate: 12 Mbps Max.; CIN: 10 pF Typ.; Voltage Isolation: 5 kVrms; ComponentLink1URL: http://www.analog.com/en/index.html; ComponentLink1Description: Manufacturer URL; ComponentLink3Description: Package Specification; PartNumber: ADUM4160BRWZ-RL; Mounting Technology: Surface Mount; DatasheetVersion: Rev. D; VBUS: 3.1 to 5.5 V; Temperature Range: -40 to 105 degC; Packing: Reel; PackageVersion: Mar-07; ComponentLink3URL: http://www.analog.com/static/imported-files/packages/PKG_PDF/SOIC_WIDE%20(RW)/RW_16.pdf; PackageDescription: 16-Pin Small Outline Integrated Circuit, Body 10.3 x 7.5 mm, Pitch 1.27 mm; ComponentLink2URL: http://www.analog.com/static/imported-files/data_sheets/ADuM4160.pdf; RoHS: TRUE; ComponentLink2Description: Datasheet

## Sheet Connectors.SchDoc: fNIRS - Connectors
size A3; CompanyName: UofT Capstone Team 2024991; Revision: 1; SheetNumber: 12; SheetTotal: 13
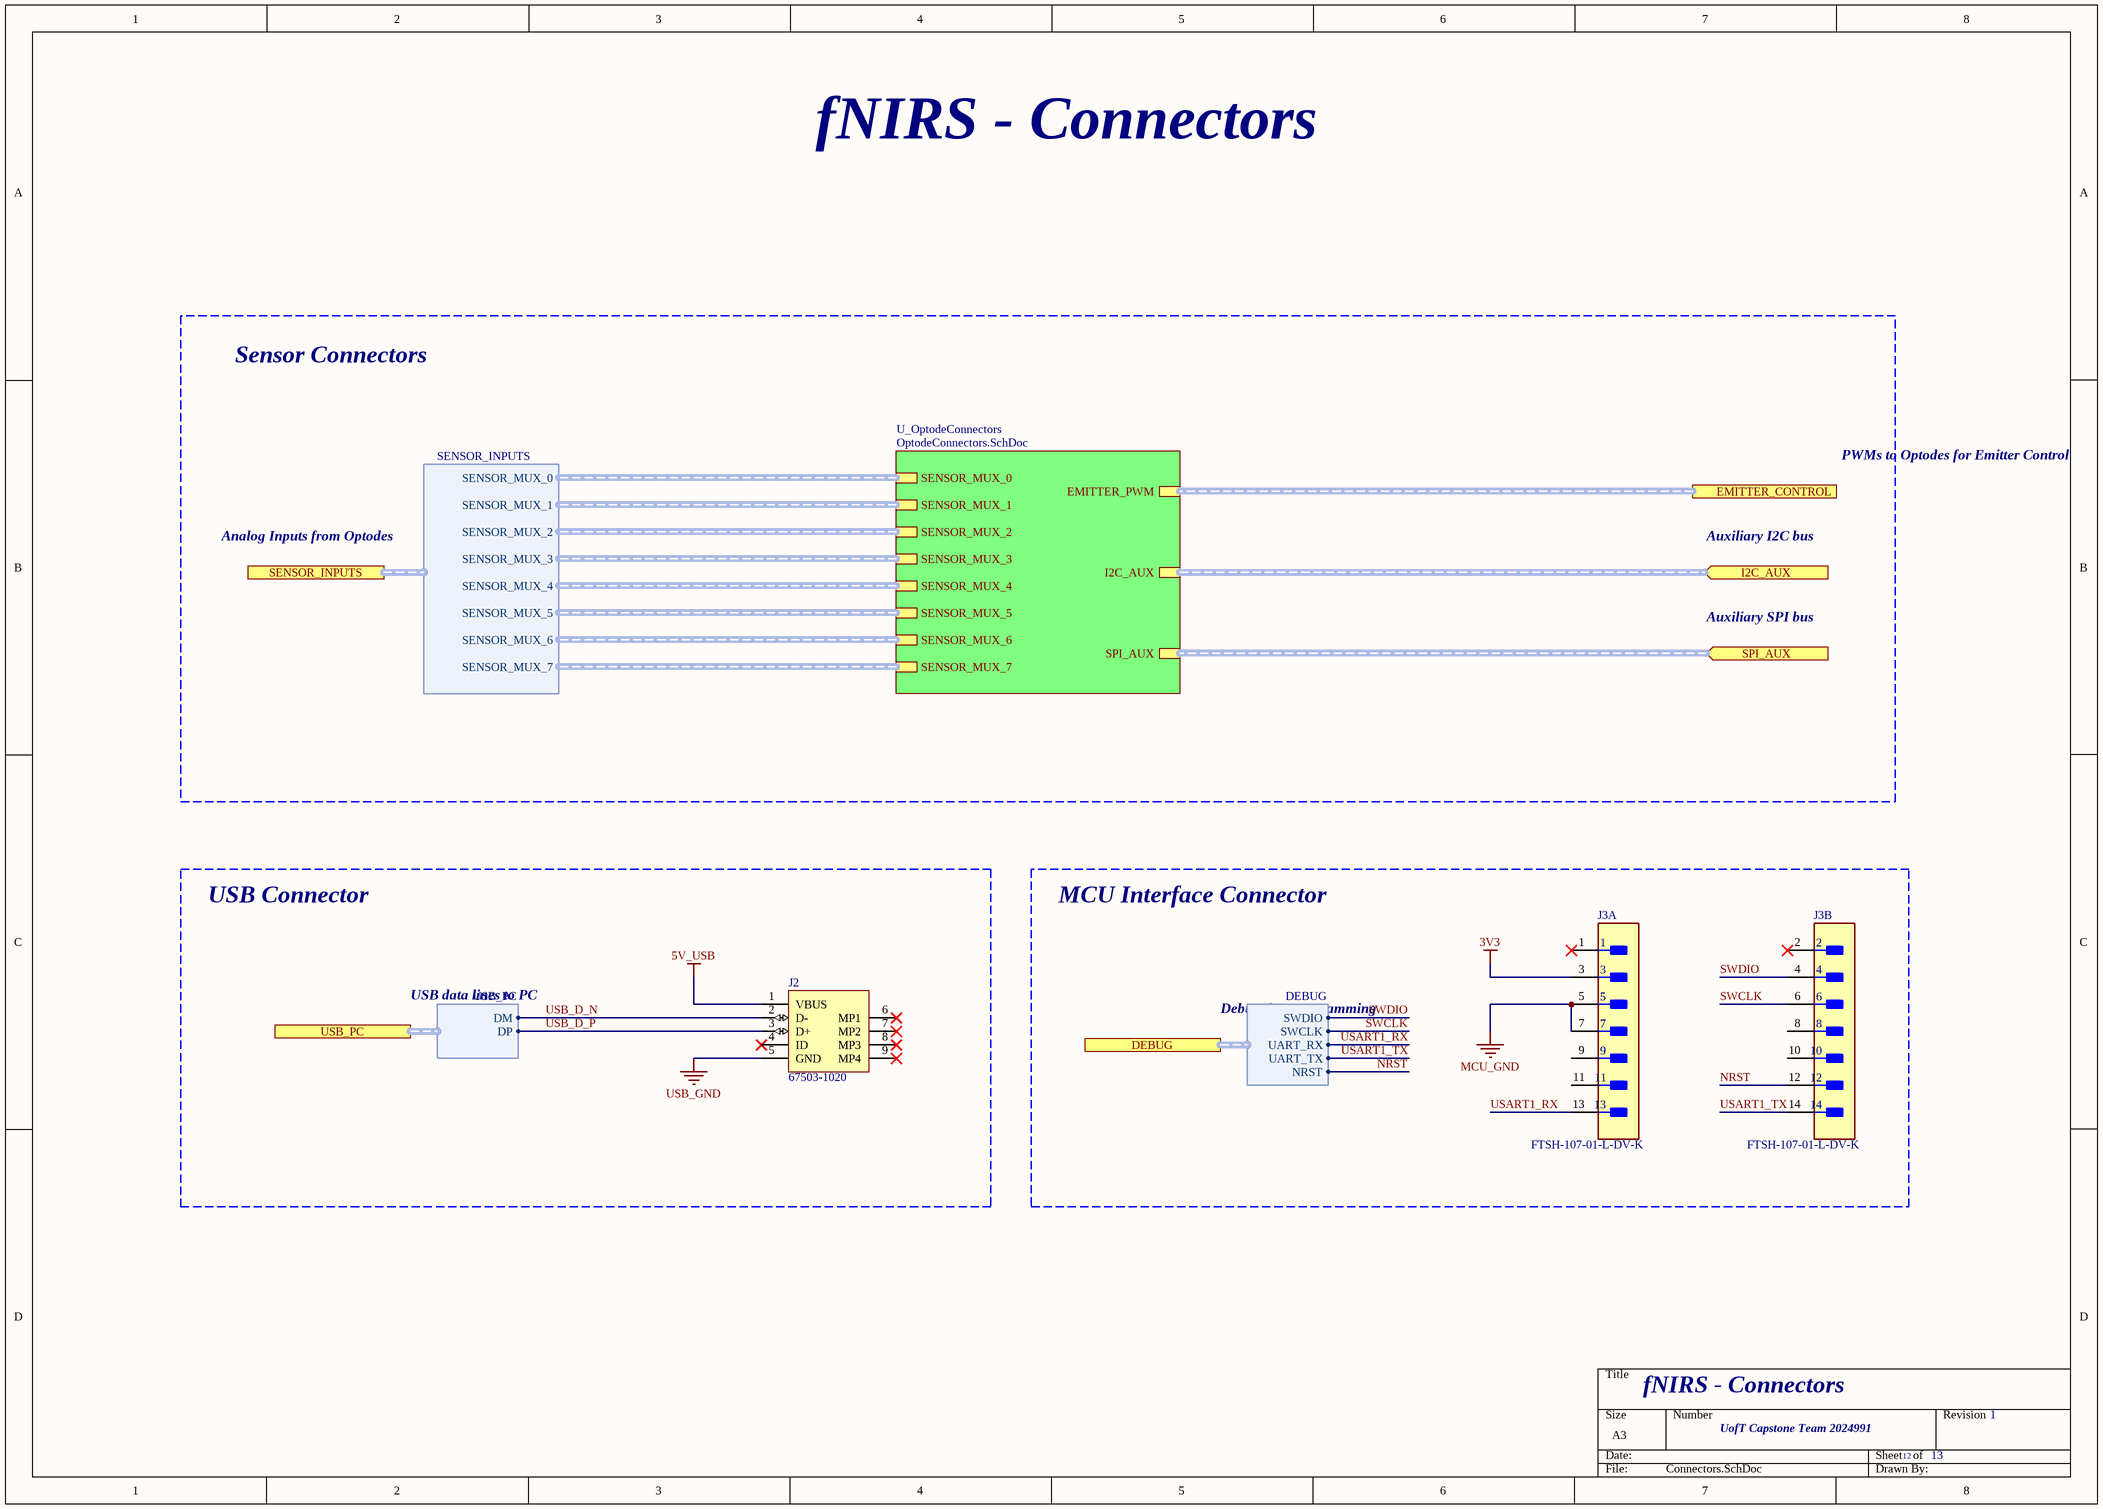
[diagram p11: Connectors.SchDoc]

### Parts
J2  67503-1020  [MOLX-67503-1020_V]
J3  FTSH-107-01-L-DV-K  [FP-FTSH-107-01-L-DV-K-MFG]  (parts A,B of 2)

### Blocks framed on the sheet
USB Connector: J2
MCU Interface Connector: J3

### Sub-sheets
U_OptodeConnectors = OptodeConnectors.SchDoc: EMITTER_PWM (harness EMITTER_PWM), SENSOR_MUX_1 (harness SENSOR_MUX_1), SENSOR_MUX_2 (harness SENSOR_MUX_2), SENSOR_MUX_3 (harness SENSOR_MUX_3), SENSOR_MUX_4 (harness SENSOR_MUX_4), SENSOR_MUX_5 (harness SENSOR_MUX_5), SENSOR_MUX_6 (harness SENSOR_MUX_6), SENSOR_MUX_7 (harness SENSOR_MUX_7), SENSOR_MUX_0 (harness SENSOR_MUX_0), SPI_AUX (harness SENSOR_MUX_7), I2C_AUX (harness SENSOR_MUX_7)

### Ports
DEBUG (harness DEBUG, see Top[3C], MCU[8C]), EMITTER_CONTROL (harness EMITTER_CONTROL, see Top[3B], OptodeControl[4B]), I2C_AUX (in, harness I2C_AUX, see Top[3C], MCU[1B], OptodeConnectors[2B]), SENSOR_INPUTS (harness SENSOR_INPUTS, see Top[3B], Sensing[1A]), SPI_AUX (in, harness SPI_AUX, see Top[3C], MCU[8D], OptodeConnectors[2A]), USB_PC (harness USB_PC, see Top[3C], MCU[1B], USBInterface[1C])

### Harnesses
USB_PC: DM, DP
SENSOR_INPUTS: SENSOR_MUX_0, SENSOR_MUX_1, SENSOR_MUX_2, SENSOR_MUX_3, SENSOR_MUX_4, SENSOR_MUX_5, SENSOR_MUX_6, SENSOR_MUX_7
DEBUG: SWDIO, SWCLK, UART_RX, UART_TX, NRST

### Nets
3V3: J3.3
5V_USB: J2.1(VBUS)
MCU_GND: J3.5 J3.7
USB_GND: J2.5(GND)
NRST: J3.12 ; port DEBUG.NRST
SWCLK: J3.6 ; port DEBUG.SWCLK
SWDIO: J3.4 ; port DEBUG.SWDIO
USART1_RX: J3.13 ; port DEBUG.UART_RX
USART1_TX: J3.14 ; port DEBUG.UART_TX
USB_D_N: J2.2(D-) ; port USB_PC.DM
USB_D_P: J2.3(D+) ; port USB_PC.DP

Not connected (* = marked no-connect by the designer): J2 4(ID)* 6(MP1)* 7(MP2)* 8(MP3)* 9(MP4)*; J3 1* 2* 8 9 10 11

### Buses and harness runs
harness port EMITTER_CONTROL = sheet U_OptodeConnectors/EMITTER_PWM
harness port I2C_AUX = sheet U_OptodeConnectors/I2C_AUX
harness port SPI_AUX = sheet U_OptodeConnectors/SPI_AUX

### Notes on the sheet
- fNIRS - Connectors
- Sensor Connectors
- PWMs to Optodes for Emitter Control
- Analog Inputs from Optodes
- Auxiliary I2C bus
- Auxiliary SPI bus
- USB data lines to PC
- Debugging/Programming

### Library data of the parts
J2 = CMP-0411-00002-1: USB, MINI, SMD, RA KME04-USBMU03A01; Manufacturer: Molex; ComponentLink1URL: http://www.molex.com/; PartNumber: 67503-1020; Mounting Technology: Surface Mount; ComponentLink1Description: Manufacturer URL; Terminal Pitch: 0.8 mm; DatasheetVersion: Rev F, 06/2009; ComponentLink2Description: Datasheet; PackageDescription: Mini USB Connector, SMT, Righer Angle; ComponentLink2URL: http://www.molex.com/pdm_docs/sd/675031020_sd.pdf; PackageReference: 67503-1020
J3 = CMP-02766-001412-1: CONN HEADER SMD 14POS 1.27MM; Number of Contacts: 14; Gender: Male; Termination: Solder; Lead Free: Lead Free; Depth: 5.84mm; Min Operating Temperature: -55°C; Length: 8.89mm; RoHS Compliant: Yes; Housing Material: Polymer; Housing Color: Black; Max Operating Temperature: 125°C; Number of Rows: 2; Pitch: 1.27mm; Radiation Hardening: No; Orientation: Straight; Packaging: Rail/Tube; Contact Material: Bronze; Contact Plating: Gold

## Sheet OptodeConnectors.SchDoc: fNIRS - Optode Connectors
size A4; CompanyName: UofT Capstone Team 2024991; Revision: 1; SheetNumber: 13; SheetTotal: 13
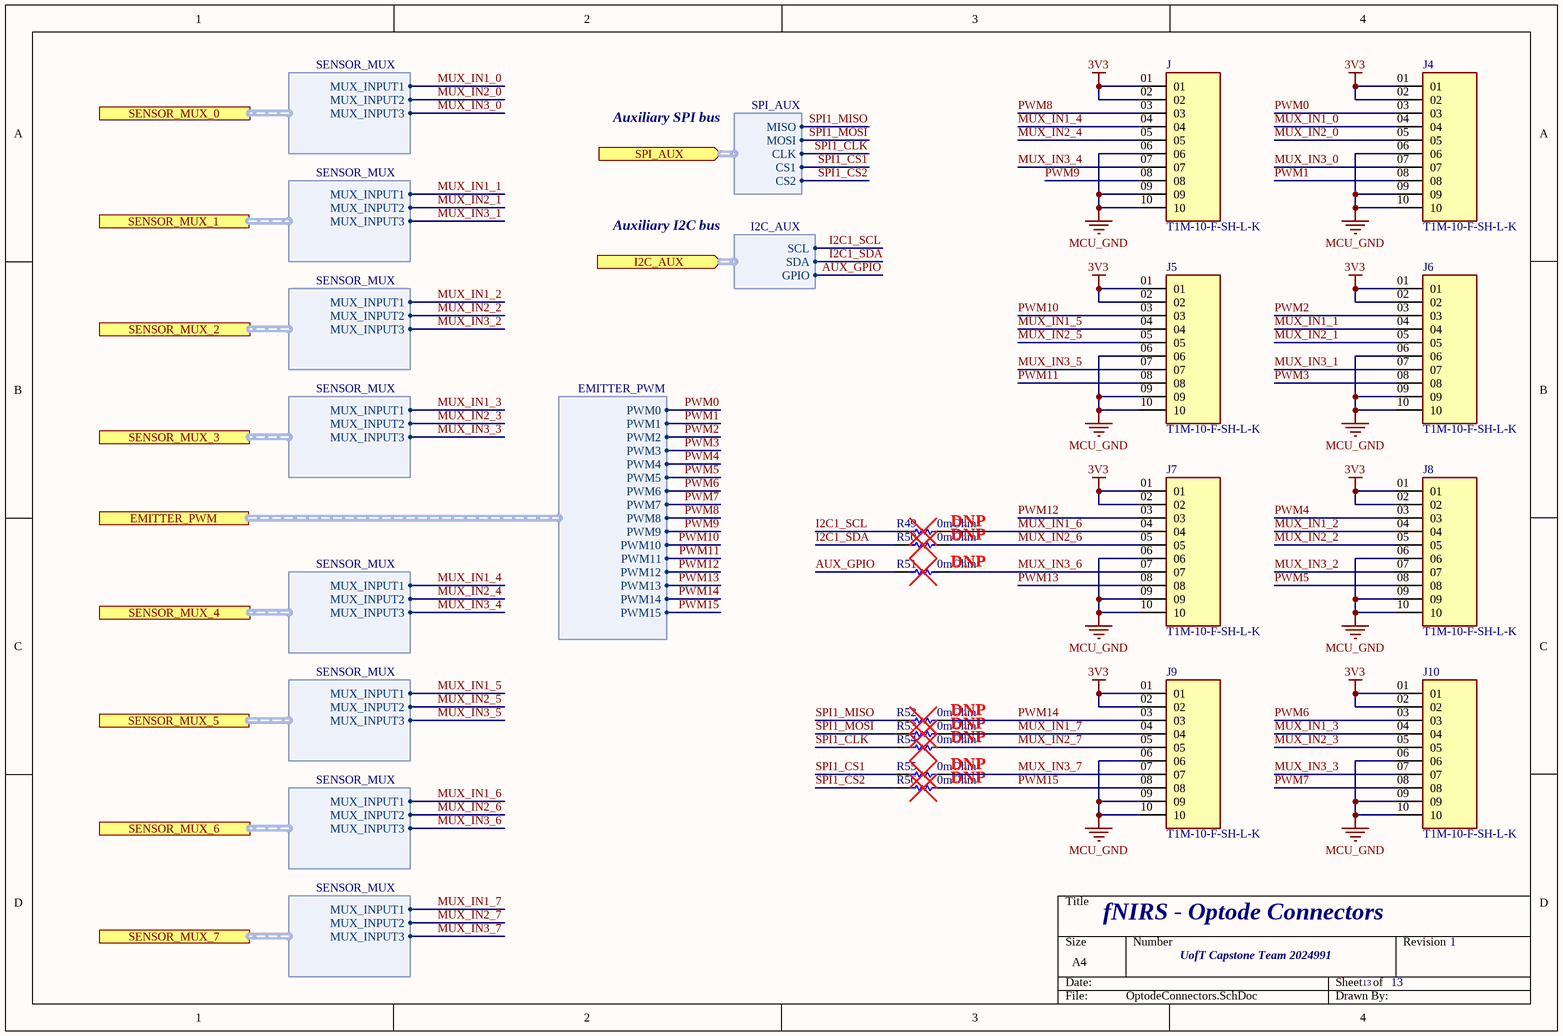
[diagram p12: OptodeConnectors.SchDoc]

### Parts
J  T1M-10-F-SH-L-K  [SAMTEC_T1M-10-F-SH-L-K]
J4  T1M-10-F-SH-L-K  [SAMTEC_T1M-10-F-SH-L-K]
J5  T1M-10-F-SH-L-K  [SAMTEC_T1M-10-F-SH-L-K]
J6  T1M-10-F-SH-L-K  [SAMTEC_T1M-10-F-SH-L-K]
J7  T1M-10-F-SH-L-K  [SAMTEC_T1M-10-F-SH-L-K]
J8  T1M-10-F-SH-L-K  [SAMTEC_T1M-10-F-SH-L-K]
J9  T1M-10-F-SH-L-K  [SAMTEC_T1M-10-F-SH-L-K]
J10  T1M-10-F-SH-L-K  [SAMTEC_T1M-10-F-SH-L-K]
R49  Resistance: 0mOhm  [RESC1608X55X25ML10T15]  (hidden comment: RC0603JR-070RL)  (no BOM)
R50  Resistance: 0mOhm  [RESC1608X55X25ML10T15]  (hidden comment: RC0603JR-070RL)  (no BOM)
R51  Resistance: 0mOhm  [RESC1608X55X25ML10T15]  (hidden comment: RC0603JR-070RL)  (no BOM)
R52  Resistance: 0mOhm  [RESC1608X55X25ML10T15]  (hidden comment: RC0603JR-070RL)  (no BOM)
R53  Resistance: 0mOhm  [RESC1608X55X25ML10T15]  (hidden comment: RC0603JR-070RL)  (no BOM)
R54  Resistance: 0mOhm  [RESC1608X55X25ML10T15]  (hidden comment: RC0603JR-070RL)  (no BOM)
R55  Resistance: 0mOhm  [RESC1608X55X25ML10T15]  (hidden comment: RC0603JR-070RL)  (no BOM)
R56  Resistance: 0mOhm  [RESC1608X55X25ML10T15]  (hidden comment: RC0603JR-070RL)  (no BOM)

### Ports
EMITTER_PWM (harness EMITTER_PWM, see Connectors[5B]), I2C_AUX (in, harness I2C_AUX, see Connectors[5B], Connectors[7B], MCU[1B]), SENSOR_MUX_0 (harness SENSOR_MUX, see Connectors[4B]), SENSOR_MUX_1 (harness SENSOR_MUX, see Connectors[4B]), SENSOR_MUX_2 (harness SENSOR_MUX, see Connectors[4B]), SENSOR_MUX_3 (harness SENSOR_MUX, see Connectors[4B]), SENSOR_MUX_4 (harness SENSOR_MUX, see Connectors[4B]), SENSOR_MUX_5 (harness SENSOR_MUX, see Connectors[4B]), SENSOR_MUX_6 (harness SENSOR_MUX, see Connectors[4B]), SENSOR_MUX_7 (harness SENSOR_MUX, see Connectors[4B]), SPI_AUX (in, harness SPI_AUX, see Connectors[5B], Connectors[7B], MCU[8D])

### Harnesses
EMITTER_PWM: PWM0, PWM1, PWM2, PWM3, PWM4, PWM5, PWM6, PWM7, PWM8, PWM9, PWM10, PWM11, PWM12, PWM13, PWM14, PWM15
SENSOR_MUX: MUX_INPUT1, MUX_INPUT2, MUX_INPUT3
SPI_AUX: MISO, MOSI, CLK, CS1, CS2
I2C_AUX: SCL, SDA, GPIO

### Nets
3V3: J.01 J.02 J4.01 J4.02 J5.01 J5.02 J6.01 J6.02 J7.01 J7.02 J8.01 J8.02 J9.01 J9.02 J10.01 J10.02
MCU_GND: J.06 J.09 J.10 J4.06 J4.09 J4.10 J5.06 J5.09 J5.10 J6.06 J6.09 J6.10 J7.06 J7.09 J7.10 J8.06 J8.09 J8.10 J9.06 J9.09 J9.10 J10.06 J10.09 J10.10
AUX_GPIO: R51.2 ; port I2C_AUX.GPIO
I2C1_SCL: R49.2 ; port I2C_AUX.SCL
I2C1_SDA: R50.2 ; port I2C_AUX.SDA
MUX_IN1_0: J4.04 ; port SENSOR_MUX_0.MUX_INPUT1
MUX_IN1_1: J6.04 ; port SENSOR_MUX_1.MUX_INPUT1
MUX_IN1_2: J8.04 ; port SENSOR_MUX_2.MUX_INPUT1
MUX_IN1_3: J10.04 ; port SENSOR_MUX_3.MUX_INPUT1
MUX_IN1_4: J.04 ; port SENSOR_MUX_4.MUX_INPUT1
MUX_IN1_5: J5.04 ; port SENSOR_MUX_5.MUX_INPUT1
MUX_IN1_6: J7.04 R49.1 ; port SENSOR_MUX_6.MUX_INPUT1
MUX_IN1_7: J9.04 R53.1 ; port SENSOR_MUX_7.MUX_INPUT1
MUX_IN2_0: J4.05 ; port SENSOR_MUX_0.MUX_INPUT2
MUX_IN2_1: J6.05 ; port SENSOR_MUX_1.MUX_INPUT2
MUX_IN2_2: J8.05 ; port SENSOR_MUX_2.MUX_INPUT2
MUX_IN2_3: J10.05 ; port SENSOR_MUX_3.MUX_INPUT2
MUX_IN2_4: J.05 ; port SENSOR_MUX_4.MUX_INPUT2
MUX_IN2_5: J5.05 ; port SENSOR_MUX_5.MUX_INPUT2
MUX_IN2_6: J7.05 R50.1 ; port SENSOR_MUX_6.MUX_INPUT2
MUX_IN2_7: J9.05 R54.1 ; port SENSOR_MUX_7.MUX_INPUT2
MUX_IN3_0: J4.07 ; port SENSOR_MUX_0.MUX_INPUT3
MUX_IN3_1: J6.07 ; port SENSOR_MUX_1.MUX_INPUT3
MUX_IN3_2: J8.07 ; port SENSOR_MUX_2.MUX_INPUT3
MUX_IN3_3: J10.07 ; port SENSOR_MUX_3.MUX_INPUT3
MUX_IN3_4: J.07 ; port SENSOR_MUX_4.MUX_INPUT3
MUX_IN3_5: J5.07 ; port SENSOR_MUX_5.MUX_INPUT3
MUX_IN3_6: J7.07 R51.1 ; port SENSOR_MUX_6.MUX_INPUT3
MUX_IN3_7: J9.07 R55.1 ; port SENSOR_MUX_7.MUX_INPUT3
PWM0: J4.03 ; port EMITTER_PWM.PWM0
PWM1: J4.08 ; port EMITTER_PWM.PWM1
PWM2: J6.03 ; port EMITTER_PWM.PWM2
PWM3: J6.08 ; port EMITTER_PWM.PWM3
PWM4: J8.03 ; port EMITTER_PWM.PWM4
PWM5: J8.08 ; port EMITTER_PWM.PWM5
PWM6: J10.03 ; port EMITTER_PWM.PWM6
PWM7: J10.08 ; port EMITTER_PWM.PWM7
PWM8: J.03 ; port EMITTER_PWM.PWM8
PWM9: J.08 ; port EMITTER_PWM.PWM9
PWM10: J5.03 ; port EMITTER_PWM.PWM10
PWM11: J5.08 ; port EMITTER_PWM.PWM11
PWM12: J7.03 ; port EMITTER_PWM.PWM12
PWM13: J7.08 ; port EMITTER_PWM.PWM13
PWM14: J9.03 R52.1 ; port EMITTER_PWM.PWM14
PWM15: J9.08 R56.1 ; port EMITTER_PWM.PWM15
SPI1_CLK: R54.2 ; port SPI_AUX.CLK
SPI1_CS1: R55.2 ; port SPI_AUX.CS1
SPI1_CS2: R56.2 ; port SPI_AUX.CS2
SPI1_MISO: R52.2 ; port SPI_AUX.MISO
SPI1_MOSI: R53.2 ; port SPI_AUX.MOSI

### Notes on the sheet
- Auxiliary SPI bus
- Auxiliary I2C bus
- DNP

### Library data of the parts
J J4-J10 = T1M-10-F-SH-L-K: MF: Samtec; Value: *; Package: None; MP: T1M-10-F-SH-L-K; Price: None; Availability: Unavailable
R49-R56 = CMP-2100-03667-1: as R7 on sheet MCU; Width: 0.8mm; Max Operating Temperature: 155degC; Tolerance: 5%; Package Reference: 0603; Height: 0.45mm; Depth: 0.8mm; Package Description: 2-Pin Surface Mount Device, Body 1.6 x 0.8 mm; Termination: SMD/SMT; Package Quantity: 5000; Case/Package: 0603; Case Code (Imperial): 0603; Radiation Hardening: No; Number of Pins: 2; Length: 1.6mm; Lead Free: LeadFree; Voltage Rating (DC): 50V; Military Standard: Not; Datasheet URL: http://www.yageo.com/NewPortal/yageodocoutput?fileName=/pdf/R-Chip/PYu-RC_Group_51_RoHS_L_5.pdf; Manufacturer URL: http://www.yageo.com/; Packaging: TapeandReel; Case Code (Metric): 1608; Min Operating Temperature: -55degC; Composition: ThickFilm; RoHSCompliant: true; Contact Plating: Tin; Datasheet Version: Rev. 5, 10/2016; REACH SVHC: NoSVHC